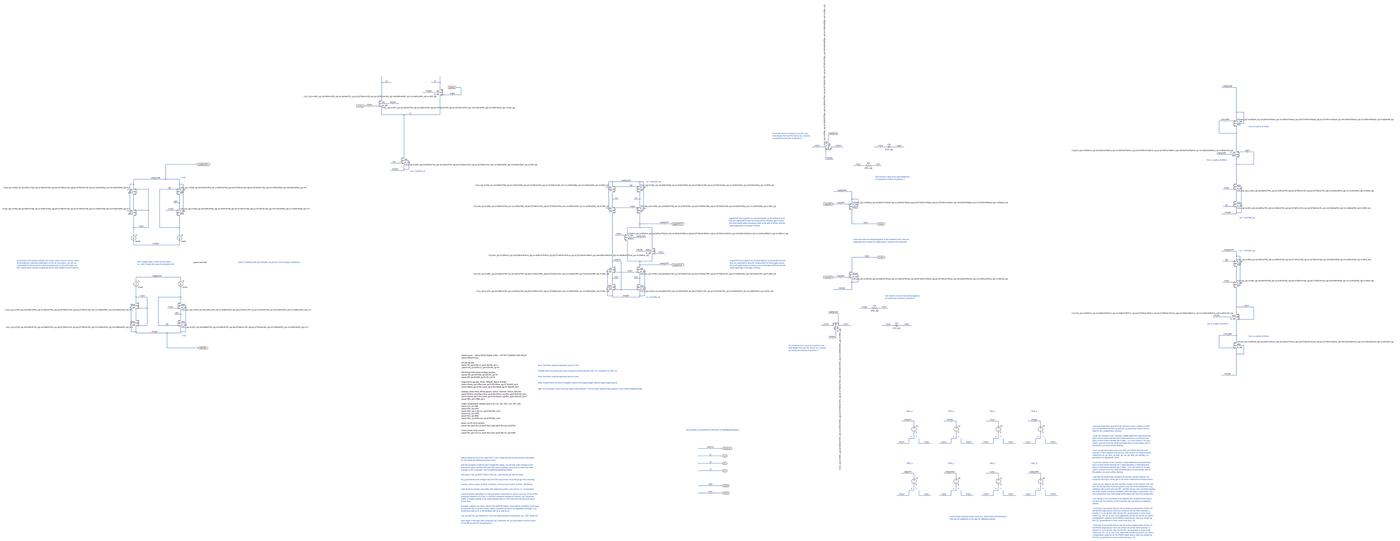
[diagram p0: schematic amp_schematic_typeB_nmos_diff_pair.asc, whole sheet]
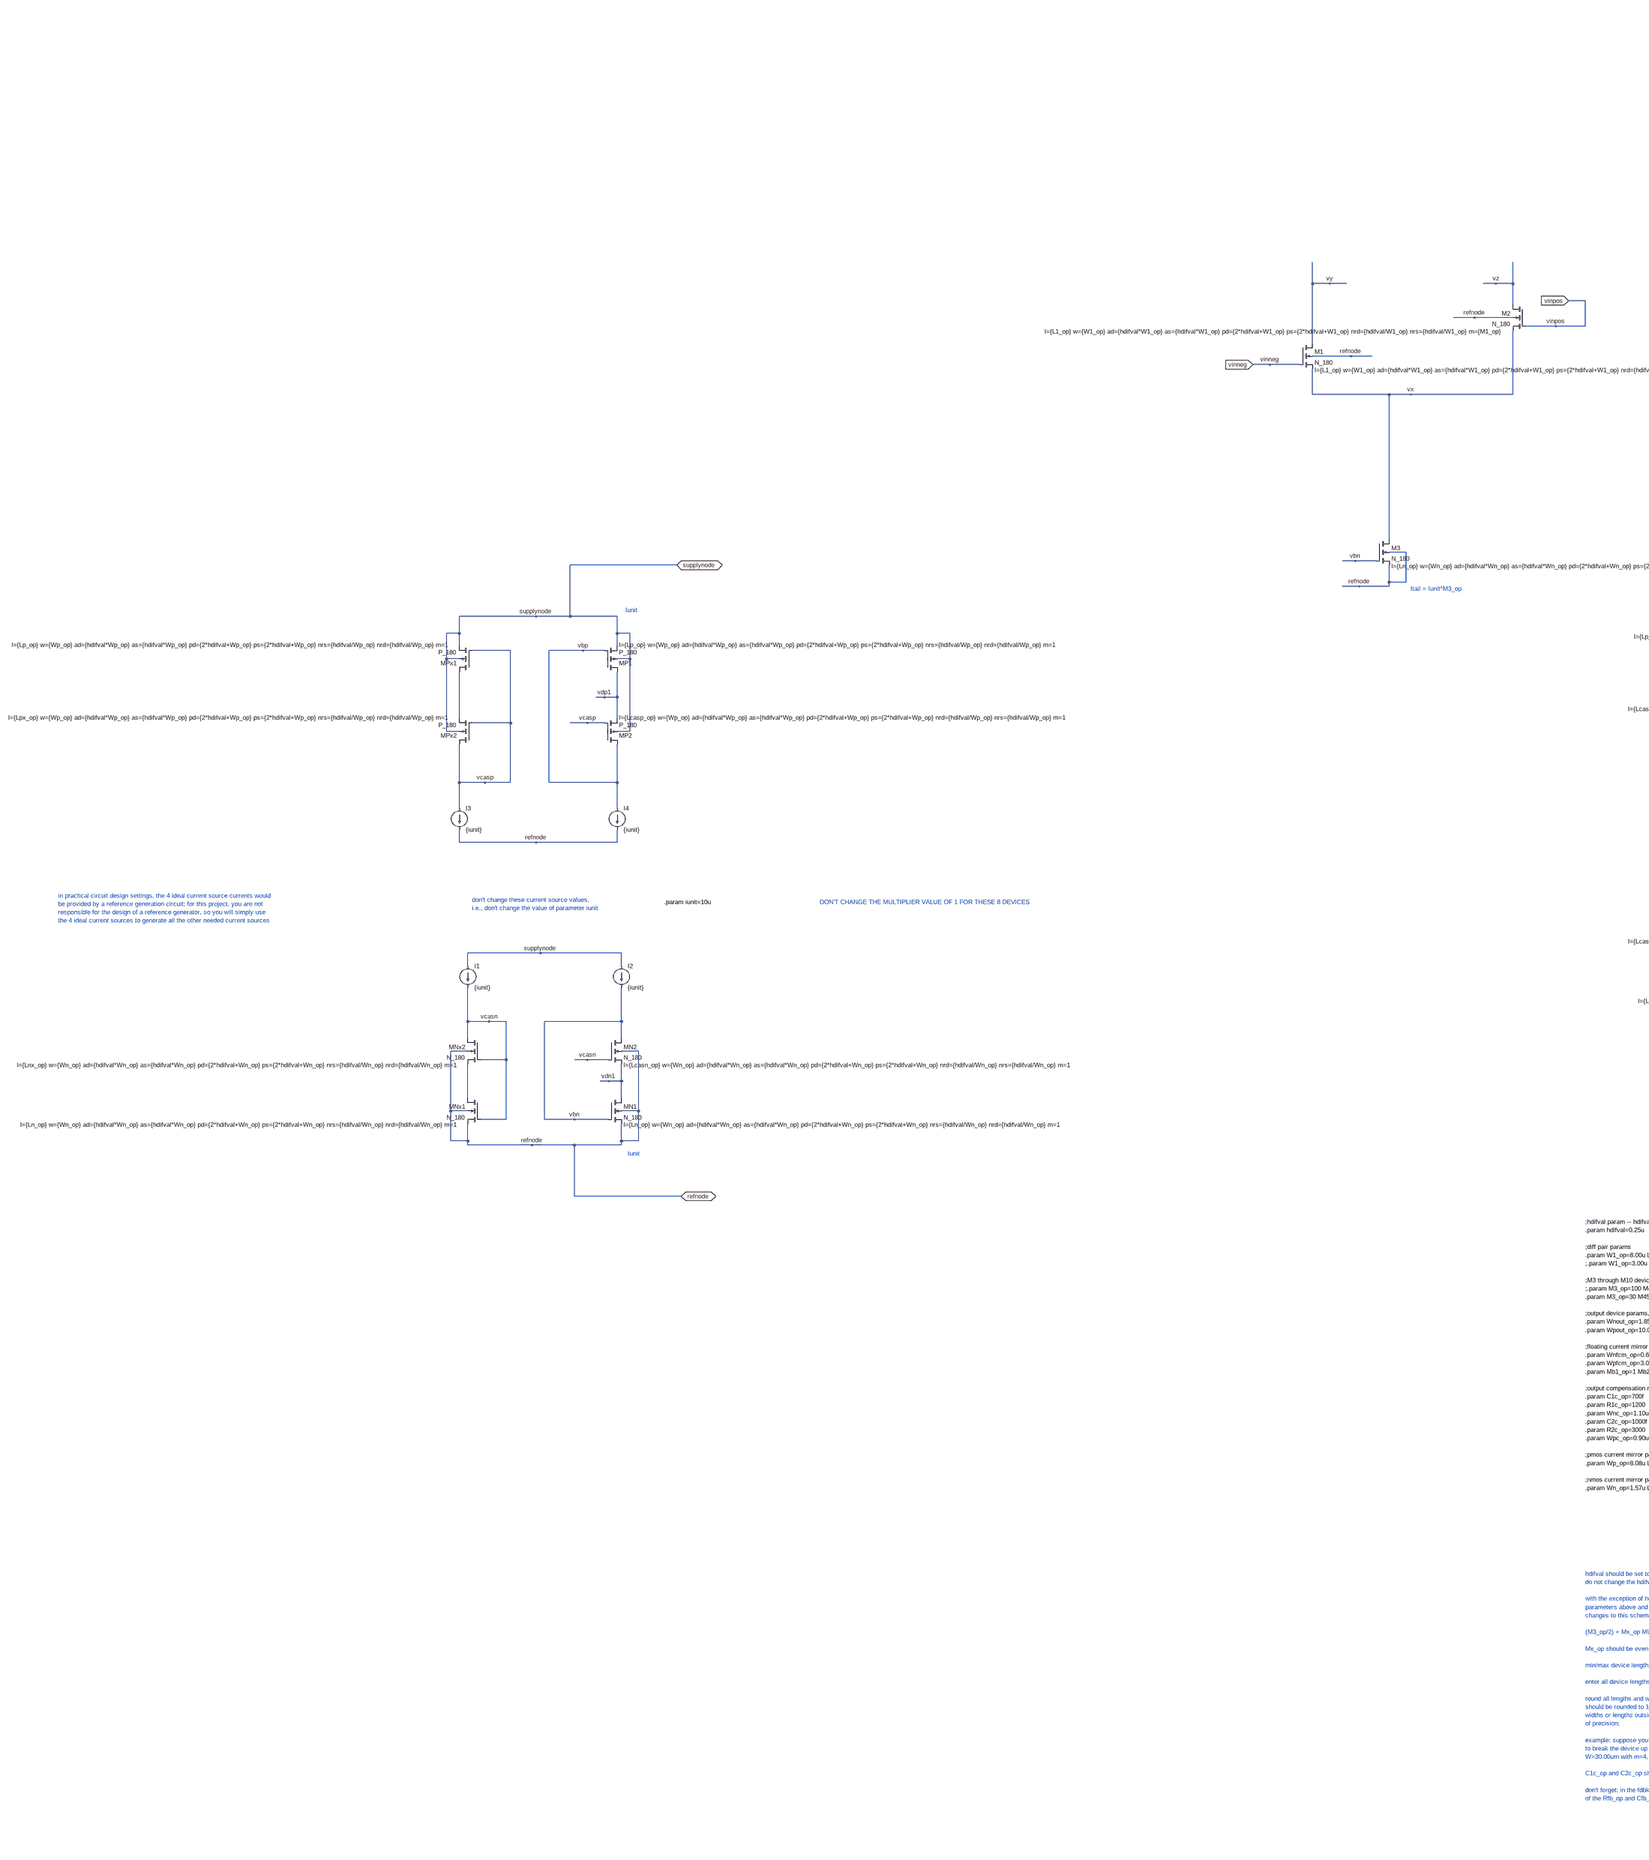
[diagram p1: schematic amp_schematic_typeB_nmos_diff_pair.asc, part, row 1 of 1, column 1 of 3]
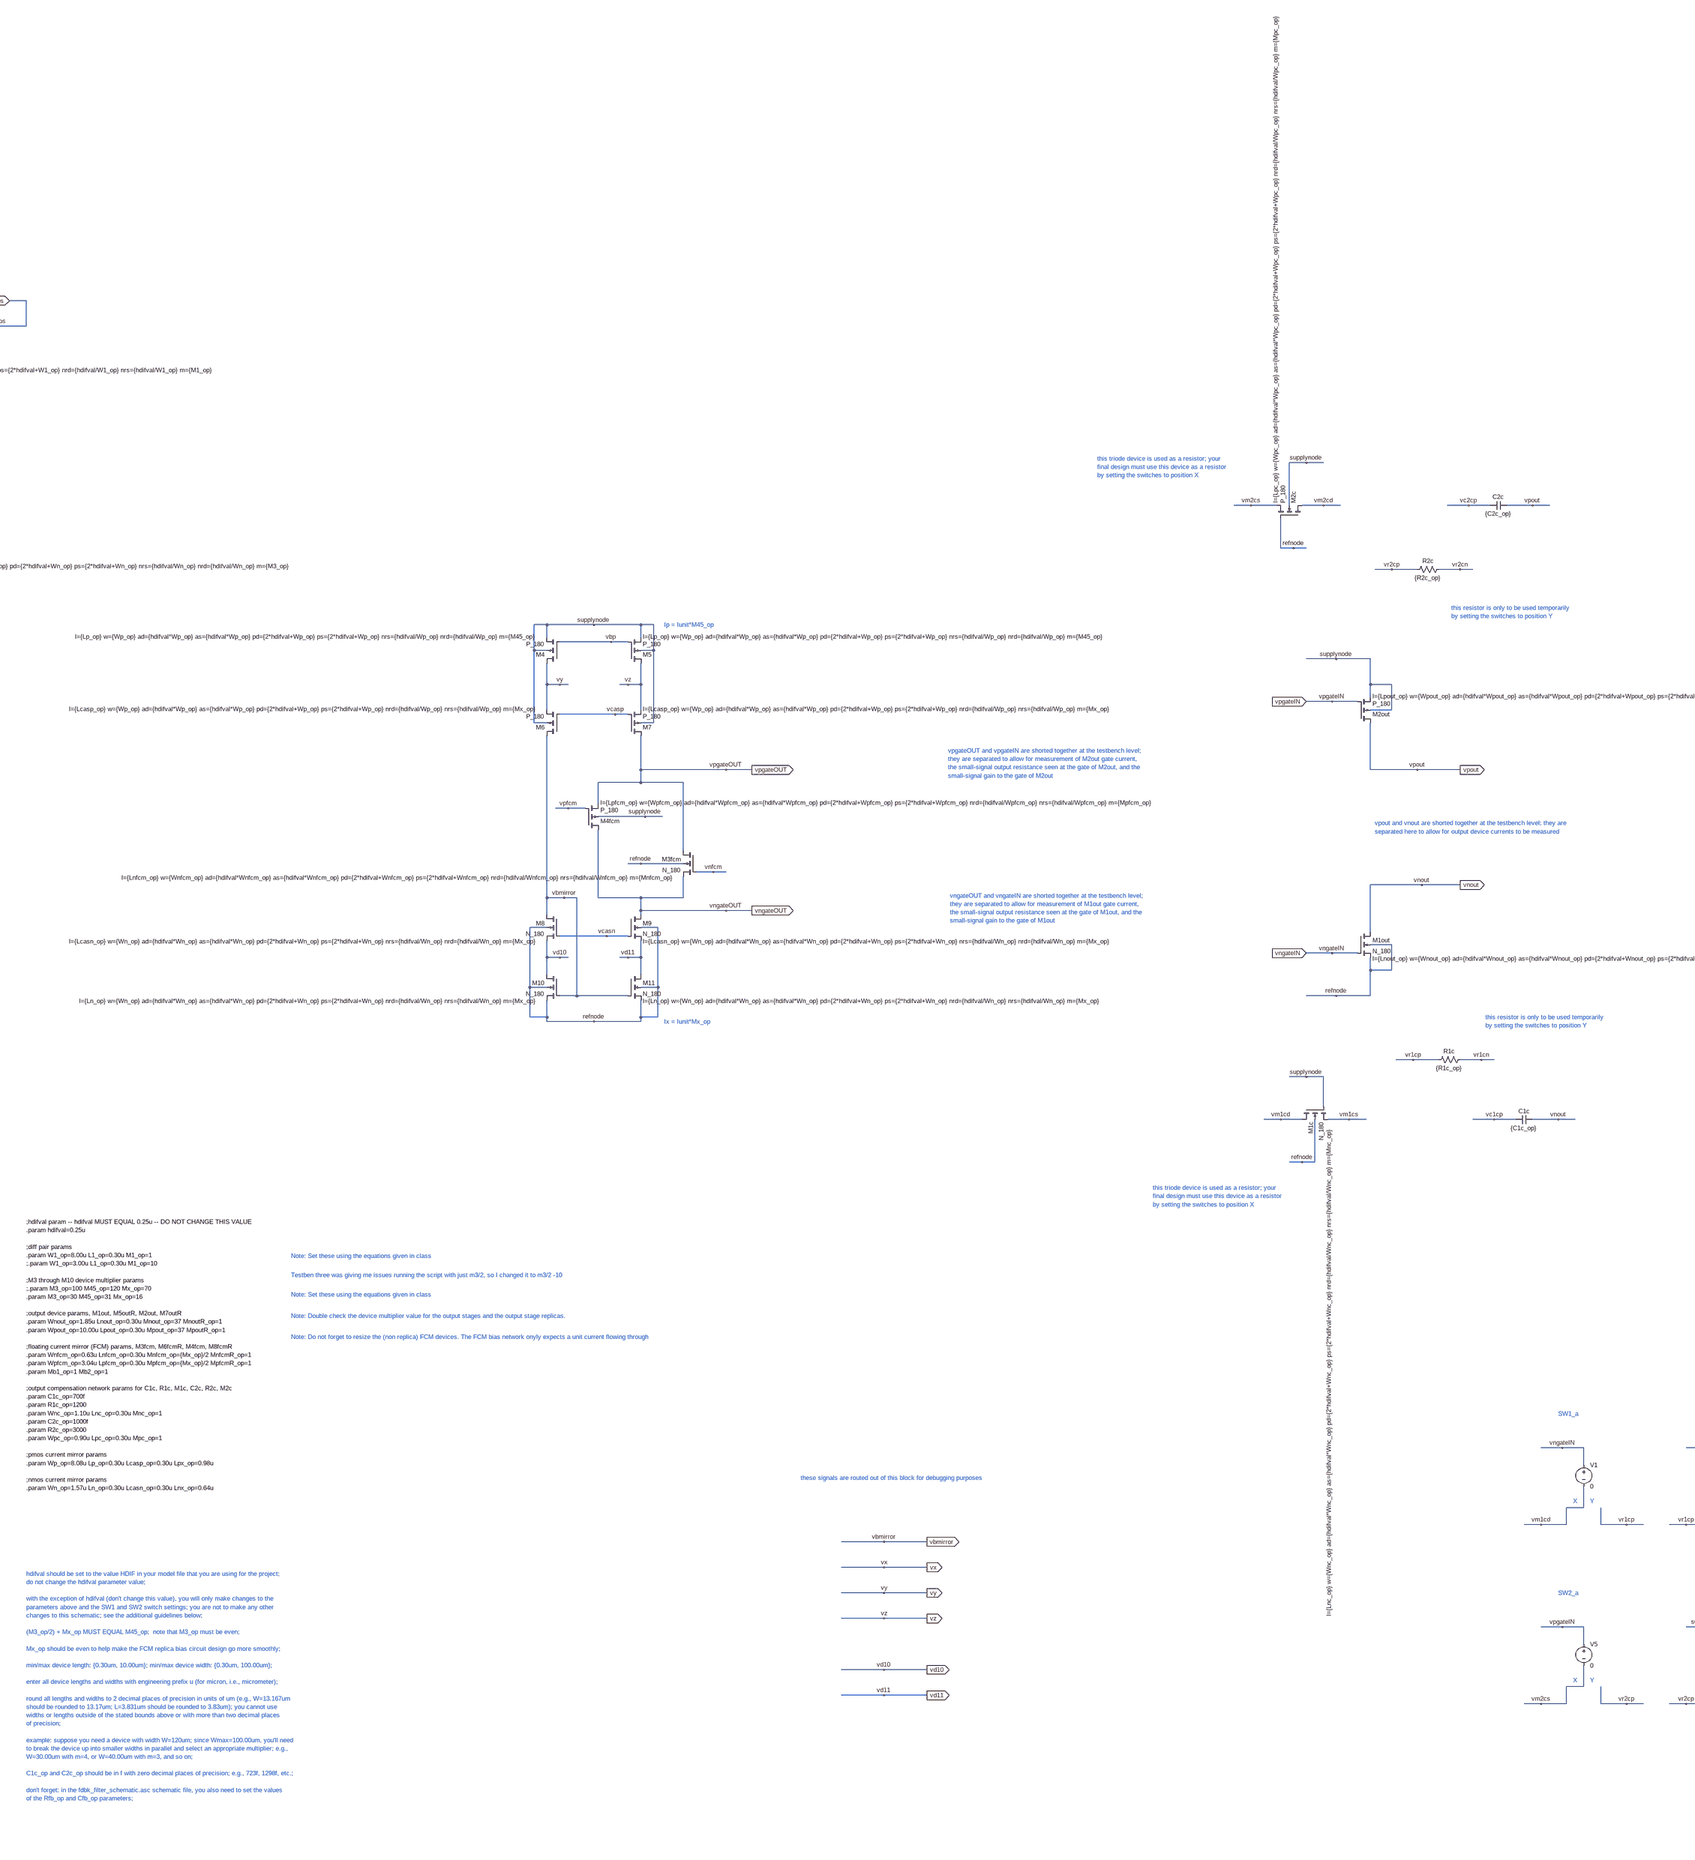
[diagram p2: schematic amp_schematic_typeB_nmos_diff_pair.asc, part, row 1 of 1, column 2 of 3]
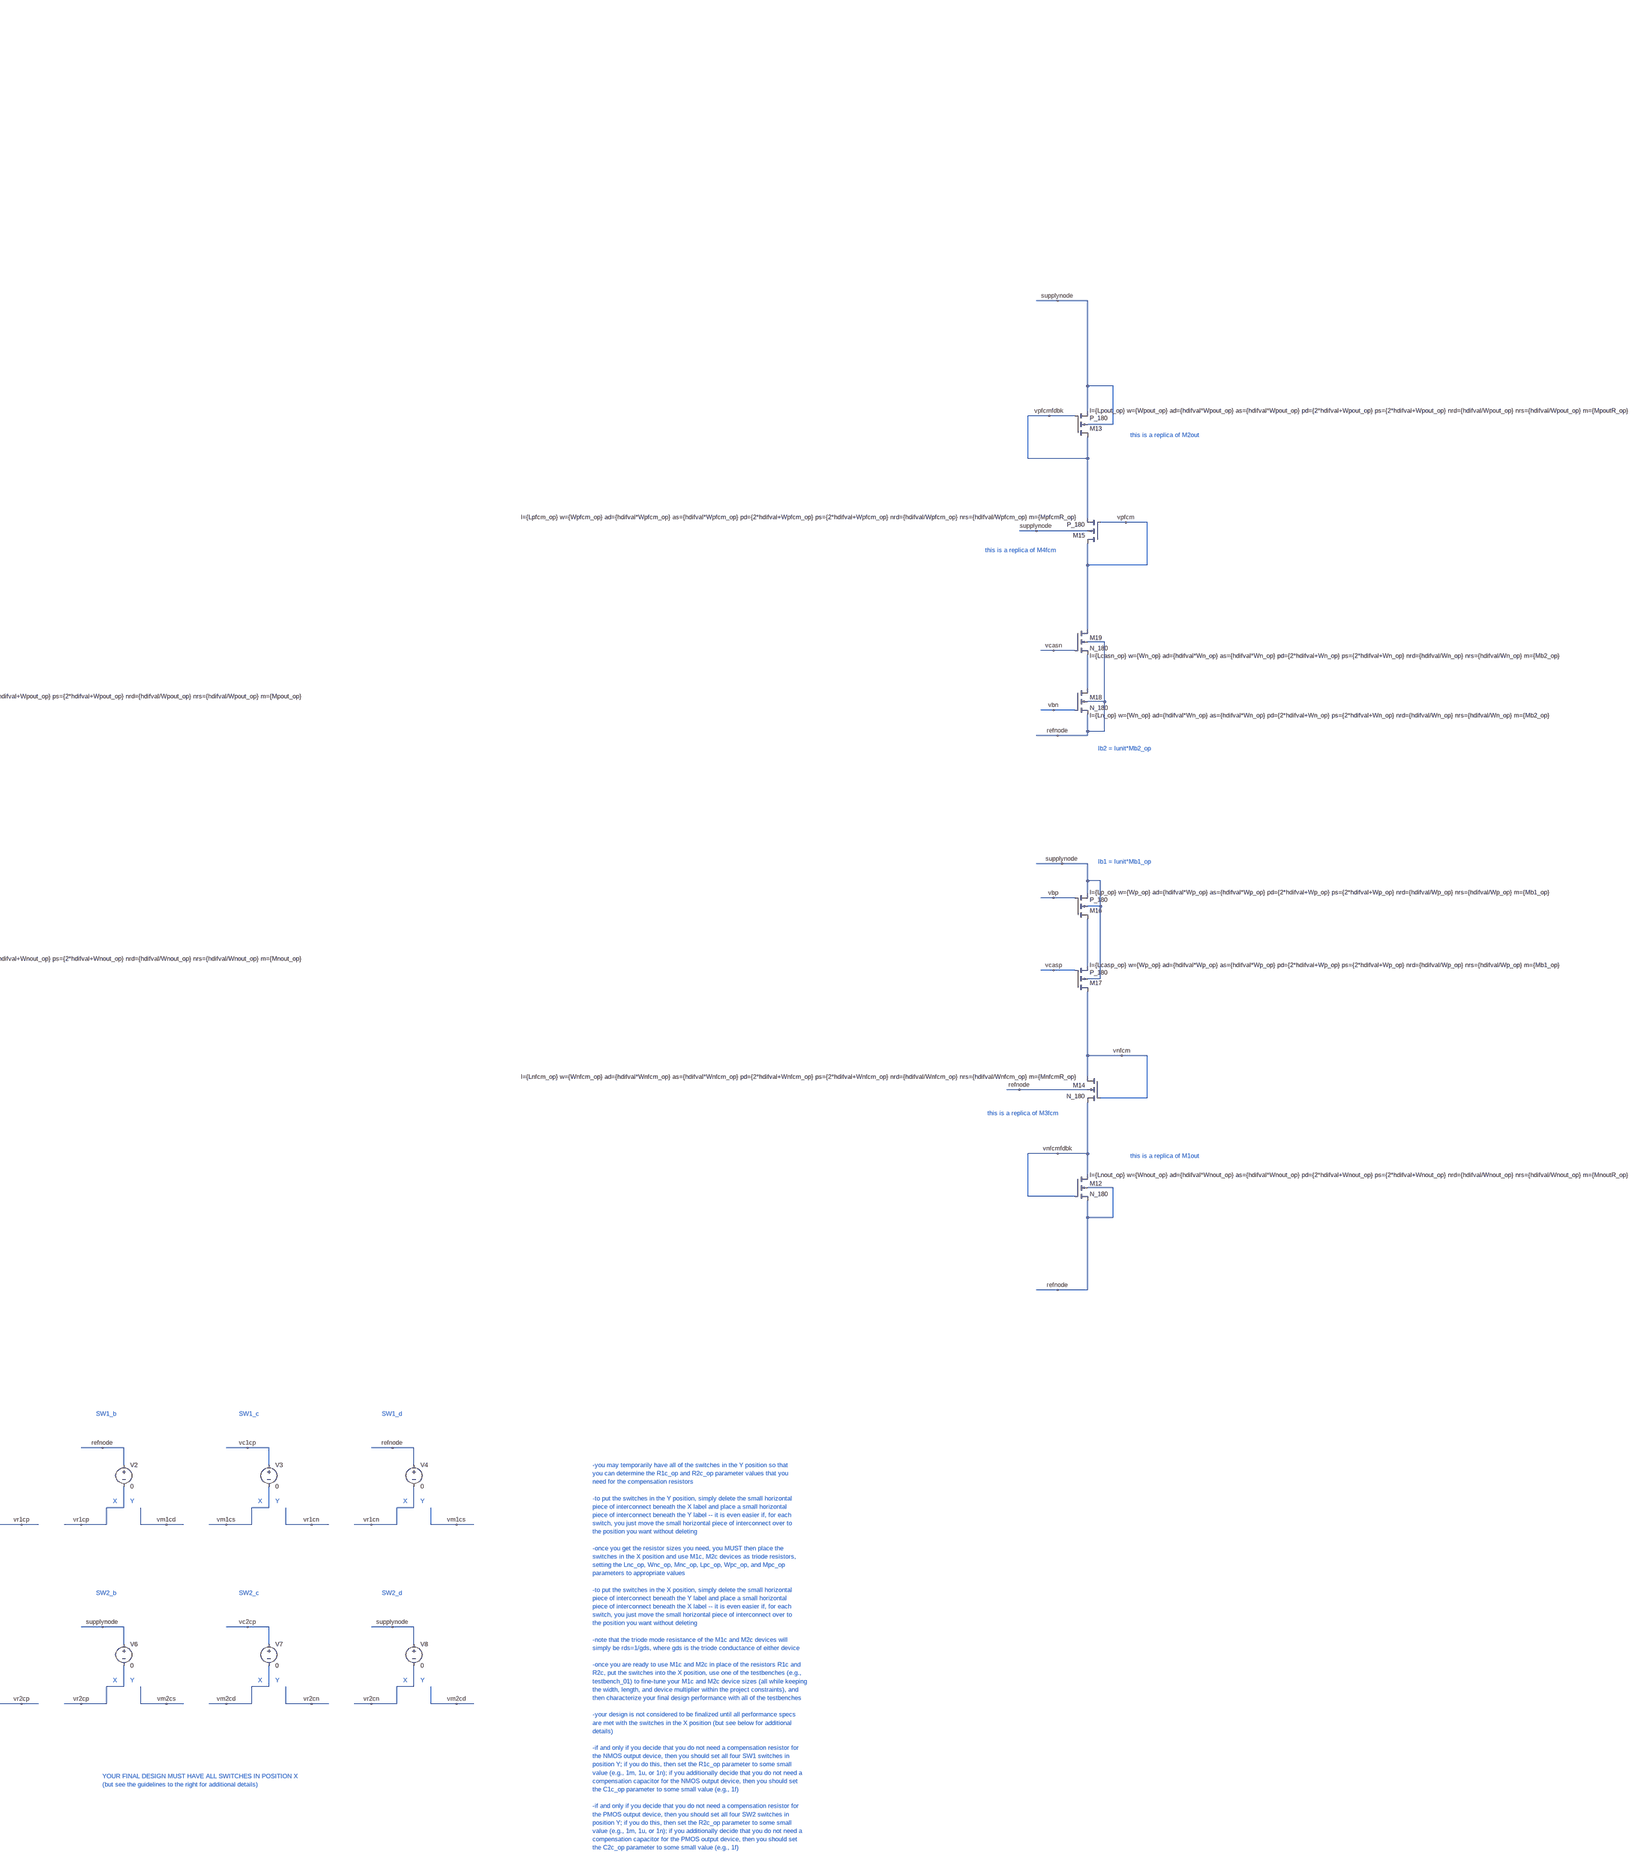
[diagram p3: schematic amp_schematic_typeB_nmos_diff_pair.asc, part, row 1 of 1, column 3 of 3]
* amp_schematic_typeB_nmos_diff_pair.asc
MN1 vdn1 vbn refnode refnode N_180 l={Ln_op} w={Wn_op} ad={hdifval*Wn_op} as={hdifval*Wn_op} pd={2*hdifval+Wn_op} ps={2*hdifval+Wn_op} nrs={hdifval/Wn_op} nrd={hdifval/Wn_op} m=1
MN2 vbn vcasn vdn1 refnode N_180 l={Lcasn_op} w={Wn_op} ad={hdifval*Wn_op} as={hdifval*Wn_op} pd={2*hdifval+Wn_op} ps={2*hdifval+Wn_op} nrd={hdifval/Wn_op} nrs={hdifval/Wn_op} m=1
MNx1 N004 vcasn refnode refnode N_180 l={Ln_op} w={Wn_op} ad={hdifval*Wn_op} as={hdifval*Wn_op} pd={2*hdifval+Wn_op} ps={2*hdifval+Wn_op} nrs={hdifval/Wn_op} nrd={hdifval/Wn_op} m=1
MNx2 vcasn vcasn N004 refnode N_180 l={Lnx_op} w={Wn_op} ad={hdifval*Wn_op} as={hdifval*Wn_op} pd={2*hdifval+Wn_op} ps={2*hdifval+Wn_op} nrs={hdifval/Wn_op} nrd={hdifval/Wn_op} m=1
MP1 vdp1 vbp supplynode supplynode P_180 l={Lp_op} w={Wp_op} ad={hdifval*Wp_op} as={hdifval*Wp_op} pd={2*hdifval+Wp_op} ps={2*hdifval+Wp_op} nrs={hdifval/Wp_op} nrd={hdifval/Wp_op} m=1
MP2 vbp vcasp vdp1 supplynode P_180 l={Lcasp_op} w={Wp_op} ad={hdifval*Wp_op} as={hdifval*Wp_op} pd={2*hdifval+Wp_op} ps={2*hdifval+Wp_op} nrd={hdifval/Wp_op} nrs={hdifval/Wp_op} m=1
MPx1 N002 vcasp supplynode supplynode P_180 l={Lp_op} w={Wp_op} ad={hdifval*Wp_op} as={hdifval*Wp_op} pd={2*hdifval+Wp_op} ps={2*hdifval+Wp_op} nrs={hdifval/Wp_op} nrd={hdifval/Wp_op} m=1
MPx2 vcasp vcasp N002 supplynode P_180 l={Lpx_op} w={Wp_op} ad={hdifval*Wp_op} as={hdifval*Wp_op} pd={2*hdifval+Wp_op} ps={2*hdifval+Wp_op} nrs={hdifval/Wp_op} nrd={hdifval/Wp_op} m=1
I1 supplynode vcasn {iunit}
I2 supplynode vbn {iunit}
I3 vcasp refnode {iunit}
I4 vbp refnode {iunit}
M11 vd11 vbmirror refnode refnode N_180 l={Ln_op} w={Wn_op} ad={hdifval*Wn_op} as={hdifval*Wn_op} pd={2*hdifval+Wn_op} ps={2*hdifval+Wn_op} nrd={hdifval/Wn_op} nrs={hdifval/Wn_op} m={Mx_op}
M9 vngateOUT vcasn vd11 refnode N_180 l={Lcasn_op} w={Wn_op} ad={hdifval*Wn_op} as={hdifval*Wn_op} pd={2*hdifval+Wn_op} ps={2*hdifval+Wn_op} nrs={hdifval/Wn_op} nrd={hdifval/Wn_op} m={Mx_op}
M10 vd10 vbmirror refnode refnode N_180 l={Ln_op} w={Wn_op} ad={hdifval*Wn_op} as={hdifval*Wn_op} pd={2*hdifval+Wn_op} ps={2*hdifval+Wn_op} nrd={hdifval/Wn_op} nrs={hdifval/Wn_op} m={Mx_op}
M8 vbmirror vcasn vd10 refnode N_180 l={Lcasn_op} w={Wn_op} ad={hdifval*Wn_op} as={hdifval*Wn_op} pd={2*hdifval+Wn_op} ps={2*hdifval+Wn_op} nrs={hdifval/Wn_op} nrd={hdifval/Wn_op} m={Mx_op}
M5 vz vbp supplynode supplynode P_180 l={Lp_op} w={Wp_op} ad={hdifval*Wp_op} as={hdifval*Wp_op} pd={2*hdifval+Wp_op} ps={2*hdifval+Wp_op} nrs={hdifval/Wp_op} nrd={hdifval/Wp_op} m={M45_op}
M7 vpgateOUT vcasp vz supplynode P_180 l={Lcasp_op} w={Wp_op} ad={hdifval*Wp_op} as={hdifval*Wp_op} pd={2*hdifval+Wp_op} ps={2*hdifval+Wp_op} nrd={hdifval/Wp_op} nrs={hdifval/Wp_op} m={Mx_op}
M4 vy vbp supplynode supplynode P_180 l={Lp_op} w={Wp_op} ad={hdifval*Wp_op} as={hdifval*Wp_op} pd={2*hdifval+Wp_op} ps={2*hdifval+Wp_op} nrs={hdifval/Wp_op} nrd={hdifval/Wp_op} m={M45_op}
M6 vbmirror vcasp vy supplynode P_180 l={Lcasp_op} w={Wp_op} ad={hdifval*Wp_op} as={hdifval*Wp_op} pd={2*hdifval+Wp_op} ps={2*hdifval+Wp_op} nrd={hdifval/Wp_op} nrs={hdifval/Wp_op} m={Mx_op}
M3fcm vpgateOUT vnfcm vngateOUT refnode N_180 l={Lnfcm_op} w={Wnfcm_op} ad={hdifval*Wnfcm_op} as={hdifval*Wnfcm_op} pd={2*hdifval+Wnfcm_op} ps={2*hdifval+Wnfcm_op} nrd={hdifval/Wnfcm_op} nrs={hdifval/Wnfcm_op} m={Mnfcm_op}
M4fcm vngateOUT vpfcm vpgateOUT supplynode P_180 l={Lpfcm_op} w={Wpfcm_op} ad={hdifval*Wpfcm_op} as={hdifval*Wpfcm_op} pd={2*hdifval+Wpfcm_op} ps={2*hdifval+Wpfcm_op} nrd={hdifval/Wpfcm_op} nrs={hdifval/Wpfcm_op} m={Mpfcm_op}
M1out vnout vngateIN refnode refnode N_180 l={Lnout_op} w={Wnout_op} ad={hdifval*Wnout_op} as={hdifval*Wnout_op} pd={2*hdifval+Wnout_op} ps={2*hdifval+Wnout_op} nrd={hdifval/Wnout_op} nrs={hdifval/Wnout_op} m={Mnout_op}
M2out vpout vpgateIN supplynode supplynode P_180 l={Lpout_op} w={Wpout_op} ad={hdifval*Wpout_op} as={hdifval*Wpout_op} pd={2*hdifval+Wpout_op} ps={2*hdifval+Wpout_op} nrd={hdifval/Wpout_op} nrs={hdifval/Wpout_op} m={Mpout_op}
M1 vy vinneg vx refnode N_180 l={L1_op} w={W1_op} ad={hdifval*W1_op} as={hdifval*W1_op} pd={2*hdifval+W1_op} ps={2*hdifval+W1_op} nrd={hdifval/W1_op} nrs={hdifval/W1_op} m={M1_op}
M2 vz vinpos vx refnode N_180 l={L1_op} w={W1_op} ad={hdifval*W1_op} as={hdifval*W1_op} pd={2*hdifval+W1_op} ps={2*hdifval+W1_op} nrd={hdifval/W1_op} nrs={hdifval/W1_op} m={M1_op}
M3 vx vbn refnode refnode N_180 l={Ln_op} w={Wn_op} ad={hdifval*Wn_op} as={hdifval*Wn_op} pd={2*hdifval+Wn_op} ps={2*hdifval+Wn_op} nrs={hdifval/Wn_op} nrd={hdifval/Wn_op} m={M3_op}
V1 vngateIN vm1cd 0
V2 refnode vr1cp 0
V3 vc1cp vm1cs 0
V4 refnode vr1cn 0
V5 vpgateIN vm2cs 0
V6 supplynode vr2cp 0
V7 vc2cp vm2cd 0
V8 supplynode vr2cn 0
C1c vnout vc1cp {C1c_op}
M1c vm1cd supplynode vm1cs refnode N_180 l={Lnc_op} w={Wnc_op} ad={hdifval*Wnc_op} as={hdifval*Wnc_op} pd={2*hdifval+Wnc_op} ps={2*hdifval+Wnc_op} nrd={hdifval/Wnc_op} nrs={hdifval/Wnc_op} m={Mnc_op}
R1c vr1cn vr1cp {R1c_op}
C2c vpout vc2cp {C2c_op}
R2c vr2cn vr2cp {R2c_op}
M2c vm2cd refnode vm2cs supplynode P_180 l={Lpc_op} w={Wpc_op} ad={hdifval*Wpc_op} as={hdifval*Wpc_op} pd={2*hdifval+Wpc_op} ps={2*hdifval+Wpc_op} nrd={hdifval/Wpc_op} nrs={hdifval/Wpc_op} m={Mpc_op}
M12 vnfcmfdbk vnfcmfdbk refnode refnode N_180 l={Lnout_op} w={Wnout_op} ad={hdifval*Wnout_op} as={hdifval*Wnout_op} pd={2*hdifval+Wnout_op} ps={2*hdifval+Wnout_op} nrd={hdifval/Wnout_op} nrs={hdifval/Wnout_op} m={MnoutR_op}
M13 vpfcmfdbk vpfcmfdbk supplynode supplynode P_180 l={Lpout_op} w={Wpout_op} ad={hdifval*Wpout_op} as={hdifval*Wpout_op} pd={2*hdifval+Wpout_op} ps={2*hdifval+Wpout_op} nrd={hdifval/Wpout_op} nrs={hdifval/Wpout_op} m={MpoutR_op}
M14 vnfcm vnfcm vnfcmfdbk refnode N_180 l={Lnfcm_op} w={Wnfcm_op} ad={hdifval*Wnfcm_op} as={hdifval*Wnfcm_op} pd={2*hdifval+Wnfcm_op} ps={2*hdifval+Wnfcm_op} nrd={hdifval/Wnfcm_op} nrs={hdifval/Wnfcm_op} m={MnfcmR_op}
M15 vpfcm vpfcm vpfcmfdbk supplynode P_180 l={Lpfcm_op} w={Wpfcm_op} ad={hdifval*Wpfcm_op} as={hdifval*Wpfcm_op} pd={2*hdifval+Wpfcm_op} ps={2*hdifval+Wpfcm_op} nrd={hdifval/Wpfcm_op} nrs={hdifval/Wpfcm_op} m={MpfcmR_op}
M16 N003 vbp supplynode supplynode P_180 l={Lp_op} w={Wp_op} ad={hdifval*Wp_op} as={hdifval*Wp_op} pd={2*hdifval+Wp_op} ps={2*hdifval+Wp_op} nrd={hdifval/Wp_op} nrs={hdifval/Wp_op} m={Mb1_op}
M17 vnfcm vcasp N003 supplynode P_180 l={Lcasp_op} w={Wp_op} ad={hdifval*Wp_op} as={hdifval*Wp_op} pd={2*hdifval+Wp_op} ps={2*hdifval+Wp_op} nrd={hdifval/Wp_op} nrs={hdifval/Wp_op} m={Mb1_op}
M18 N001 vbn refnode refnode N_180 l={Ln_op} w={Wn_op} ad={hdifval*Wn_op} as={hdifval*Wn_op} pd={2*hdifval+Wn_op} ps={2*hdifval+Wn_op} nrd={hdifval/Wn_op} nrs={hdifval/Wn_op} m={Mb2_op}
M19 vpfcm vcasn N001 refnode N_180 l={Lcasn_op} w={Wn_op} ad={hdifval*Wn_op} as={hdifval*Wn_op} pd={2*hdifval+Wn_op} ps={2*hdifval+Wn_op} nrd={hdifval/Wn_op} nrs={hdifval/Wn_op} m={Mb2_op}
.model NMOS NMOS
.model PMOS PMOS
.lib standard.mos
;hdifval param -- hdifval MUST EQUAL 0.25u -- DO NOT CHANGE THIS VALUE
.param hdifval=0.25u
;diff pair params
.param W1_op=8.00u L1_op=0.30u M1_op=1
;.param W1_op=3.00u L1_op=0.30u M1_op=10
;M3 through M10 device multiplier params
;.param M3_op=100 M45_op=120 Mx_op=70
.param M3_op=30 M45_op=31 Mx_op=16
;output device params, M1out, M5outR, M2out, M7outR
.param Wnout_op=1.85u Lnout_op=0.30u Mnout_op=37 MnoutR_op=1
.param Wpout_op=10.00u Lpout_op=0.30u Mpout_op=37 MpoutR_op=1
;floating current mirror (FCM) params, M3fcm, M6fcmR, M4fcm, M8fcmR
.param Wnfcm_op=0.63u Lnfcm_op=0.30u Mnfcm_op={Mx_op}/2 MnfcmR_op=1
.param Wpfcm_op=3.04u Lpfcm_op=0.30u Mpfcm_op={Mx_op}/2 MpfcmR_op=1
.param Mb1_op=1 Mb2_op=1
;output compensation network params for C1c, R1c, M1c, C2c, R2c, M2c
.param C1c_op=700f
.param R1c_op=1200
.param Wnc_op=1.10u Lnc_op=0.30u Mnc_op=1
.param C2c_op=1000f
.param R2c_op=3000
.param Wpc_op=0.90u Lpc_op=0.30u Mpc_op=1
;pmos current mirror params
.param Wp_op=8.08u Lp_op=0.30u Lcasp_op=0.30u Lpx_op=0.98u
;nmos current mirror params
.param Wn_op=1.57u Ln_op=0.30u Lcasn_op=0.30u Lnx_op=0.64u
* Ip = Iunit*M45_op
* Ix = Iunit*Mx_op
* hdifval should be set to the value HDIF in your model file that you are using for the project;
* do not change the hdifval parameter value;
* with the exception of hdifval (don't change this value), you will only make changes to the
* parameters above and the SW1 and SW2 switch settings; you are not to make any other
* changes to this schematic; see the additional guidelines below;
* (M3_op/2) + Mx_op MUST EQUAL M45_op;  note that M3_op must be even;
* Mx_op should be even to help make the FCM replica bias circuit design go more smoothly;
* min/max device length: {0.30um, 10.00um}; min/max device width: {0.30um, 100.00um};
* enter all device lengths and widths with engineering prefix u (for micron, i.e., micrometer);
* round all lengths and widths to 2 decimal places of precision in units of um (e.g., W=13.167um
* should be rounded to 13.17um; L=3.831um should be rounded to 3.83um); you cannot use
* widths or lengths outside of the stated bounds above or with more than two decimal places
* of precision;
* example: suppose you need a device with width W=120um; since Wmax=100.00um, you'll need
* to break the device up into smaller widths in parallel and select an appropriate multiplier; e.g.,
* W=30.00um with m=4, or W=40.00um with m=3, and so on;
* C1c_op and C2c_op should be in f with zero decimal places of precision; e.g., 723f, 1298f, etc.;
* don't forget: in the fdbk_filter_schematic.asc schematic file, you also need to set the values
* of the Rfb_op and Cfb_op parameters;
* these signals are routed out of this block for debugging purposes
* vpout and vnout are shorted together at the testbench level; they are
* separated here to allow for output device currents to be measured
* don't change these current source values,
* i.e., don't change the value of parameter iunit
* in practical circuit design settings, the 4 ideal current source currents would
* be provided by a reference generation circuit; for this project, you are not
* responsible for the design of a reference generator, so you will simply use
* the 4 ideal current sources to generate all the other needed current sources
* Iunit
* Iunit
* vpgateOUT and vpgateIN are shorted together at the testbench level;
* they are separated to allow for measurement of M2out gate current,
* the small-signal output resistance seen at the gate of M2out, and the
* small-signal gain to the gate of M2out
* vngateOUT and vngateIN are shorted together at the testbench level;
* they are separated to allow for measurement of M1out gate current,
* the small-signal output resistance seen at the gate of M1out, and the
* small-signal gain to the gate of M1out
* Itail = Iunit*M3_op
.param iunit=10u
* X
* Y
* SW1_a
* SW1_b
* SW1_c
* SW1_d
* X
* Y
* X
* Y
* X
* Y
* X
* Y
* SW2_a
* SW2_b
* SW2_c
* SW2_d
* X
* Y
* X
* Y
* X
* Y
* -you may temporarily have all of the switches in the Y position so that
* you can determine the R1c_op and R2c_op parameter values that you
* need for the compensation resistors
* -to put the switches in the Y position, simply delete the small horizontal
* piece of interconnect beneath the X label and place a small horizontal
* piece of interconnect beneath the Y label -- it is even easier if, for each
* switch, you just move the small horizontal piece of interconnect over to
* the position you want without deleting
* -once you get the resistor sizes you need, you MUST then place the
* switches in the X position and use M1c, M2c devices as triode resistors,
* setting the Lnc_op, Wnc_op, Mnc_op, Lpc_op, Wpc_op, and Mpc_op
* parameters to appropriate values
* -to put the switches in the X position, simply delete the small horizontal
* piece of interconnect beneath the Y label and place a small horizontal
* piece of interconnect beneath the X label -- it is even easier if, for each
* switch, you just move the small horizontal piece of interconnect over to
* the position you want without deleting
* -note that the triode mode resistance of the M1c and M2c devices will
* simply be rds=1/gds, where gds is the triode conductance of either device
* -once you are ready to use M1c and M2c in place of the resistors R1c and
* R2c, put the switches into the X position, use one of the testbenches (e.g.,
* testbench_01) to fine-tune your M1c and M2c device sizes (all while keeping
* the width, length, and device multiplier within the project constraints), and
* then characterize your final design performance with all of the testbenches
* -your design is not considered to be finalized until all performance specs
* are met with the switches in the X position (but see below for additional
* details)
* -if and only if you decide that you do not need a compensation resistor for
* the NMOS output device, then you should set all four SW1 switches in
* position Y; if you do this, then set the R1c_op parameter to some small
* value (e.g., 1m, 1u, or 1n); if you additionally decide that you do not need a
* compensation capacitor for the NMOS output device, then you should set
* the C1c_op parameter to some small value (e.g., 1f)
* -if and only if you decide that you do not need a compensation resistor for
* the PMOS output device, then you should set all four SW2 switches in
* position Y; if you do this, then set the R2c_op parameter to some small
* value (e.g., 1m, 1u, or 1n); if you additionally decide that you do not need a
* compensation capacitor for the PMOS output device, then you should set
* the C2c_op parameter to some small value (e.g., 1f)
* YOUR FINAL DESIGN MUST HAVE ALL SWITCHES IN POSITION X
* (but see the guidelines to the right for additional details)
* this triode device is used as a resistor; your
* final design must use this device as a resistor
* by setting the switches to position X
* this resistor is only to be used temporarily
* by setting the switches to position Y
* this triode device is used as a resistor; your
* final design must use this device as a resistor
* by setting the switches to position X
* this resistor is only to be used temporarily
* by setting the switches to position Y
* this is a replica of M2out
* this is a replica of M1out
* this is a replica of M4fcm
* this is a replica of M3fcm
* Ib2 = Iunit*Mb2_op
* Ib1 = Iunit*Mb1_op
* DON'T CHANGE THE MULTIPLIER VALUE OF 1 FOR THESE 8 DEVICES
* Note: Do not forget to resize the (non replica) FCM devices. The FCM bias network onyly expects a unit current flowing through
* Note: Double check the device multiplier value for the output stages and the output stage replicas.
* Note: Set these using the equations given in class
* Note: Set these using the equations given in class
* Testben three was giving me issues running the script with just m3/2, so I changed it to m3/2 -10
.backanno
.end